# Altium schematic sheet 12_LED.SchDoc
size 420 x 297 mm; SheetNumber: 12; SheetTotal: 12
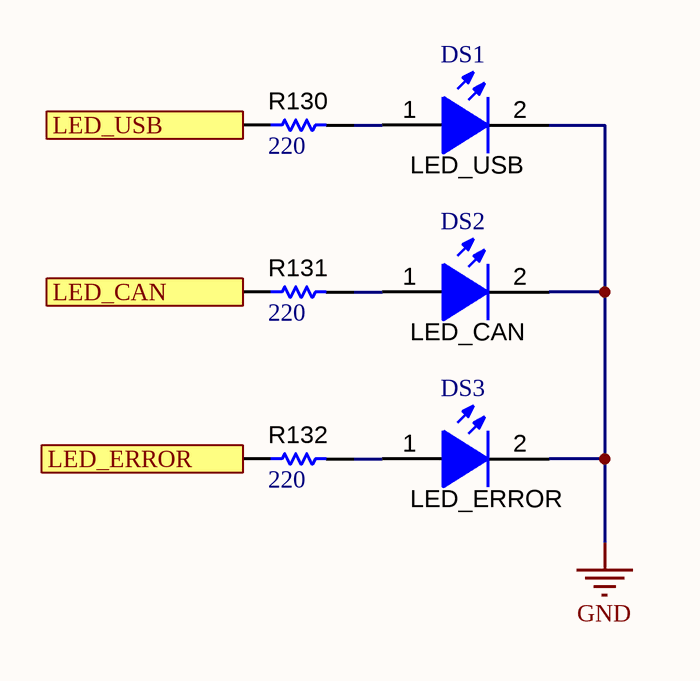
[diagram p0: 12_LED.SchDoc]

## Parts
DS1  value LED_USB  [LS L29K_Red]  (hidden comment: LS L29K-G1J2-1-Z)
DS2  value LED_CAN  [LS L29K_Red]  (hidden comment: LS L29K-G1J2-1-Z)
DS3  value LED_ERROR  [LS L29K_Red]  (hidden comment: LS L29K-G1J2-1-Z)
R130  ValueDisplayed: 220  [0402L]  (hidden comment: CRCW04021K00FKED)
R131  ValueDisplayed: 220  [0402L]  (hidden comment: CRCW04021K00FKED)
R132  ValueDisplayed: 220  [0402L]  (hidden comment: CRCW04021K00FKED)

## Ports
LED_CAN (see 04_STM32F373VBTx[5B]), LED_ERROR (see 04_STM32F373VBTx[5B]), LED_USB (see 04_STM32F373VBTx[5B])

## Nets
GND: DS1.2(K) DS2.2(K) DS3.2(K)
LED_CAN: R131.1 ; port LED_CAN
LED_ERROR: R132.1 ; port LED_ERROR
LED_USB: R130.1 ; port LED_USB
NetDS1_1: DS1.1(A) R130.2
NetDS2_1: DS2.1(A) R131.2
NetDS3_1: DS3.1(A) R132.2

## Notes on the sheet
- Sub-system:
- Project:
- Design by:
- Sheet title:
- Sheet
- of
- Checked by:
- Approved by:
- Doc No:
- Revision:
- Size:
- Date:
- A3

## Library data of the parts
DS1-DS3 = LED RED SMD: LED, Red, SMD; Manufacturer: OSRAM; Io_A: 20mA; Vr_V: 12V; Tjmax_C: 110°C; Value1: W; Angle: 160; Vf_V: 1.8V; ComponentLink1URL: http://www.osram-os.com/Graphics/XPic2/00077099_0.pdf; Color: Red; RoHS: Y; MountType: SMT; PackageReference: SMD, 2-Leads, Body 1.3x0.8mm; Value2: 1.8V; CompType: LED; Type: ?; PartNumber: LS L29K-G1J2-1-Z; ComponentLink1Description: Datasheet link
R130-R132 = RES 1K 0402: RES, 1.00 k, 1%, 0.063 W, AEC-Q200 Grade 0, 0402; Manufacturer: Vishay-Dale; Power_W: 63mW; TempCo: 100 ppm/C; Value_Code: 1k00; Value: 1.00k; EIA_Code: E96; Res_ohm: 1k; SizeX_mm: 1; SizeY_mm: 0.5; SizeZ_mm: 0.6; Value2: 0.063W; CompType: Resistor; AEC Qualified: Y; VDC_V: 50V; AEC Category: Q200; AEC Grade: 0; Supplier Part Number 2: 52K6545; Supplier 2: Newark; Supplier Part Number 3: 71-CRCW0402-1.0K-E3; Supplier 3: Mouser; RoHS: E; Value1: 1%; MountType: SMT; Supplier 1: Digi-Key; PackageReference: 0402; Tolerance_%: 1%; SizeArea_mm2: 0.5; PartNumber: CRCW04021K00FKED; ComponentLink1Description: Datasheet link; Supplier Part Number 1: 541-1.00KLCT-ND; Technology: Thick Film; ComponentLink1URL: http://www.vishay.com/docs/20035/dcrcwe3.pdf